# EAGLE design Engine Room ADUM Arduino (EAGLE 6.2)
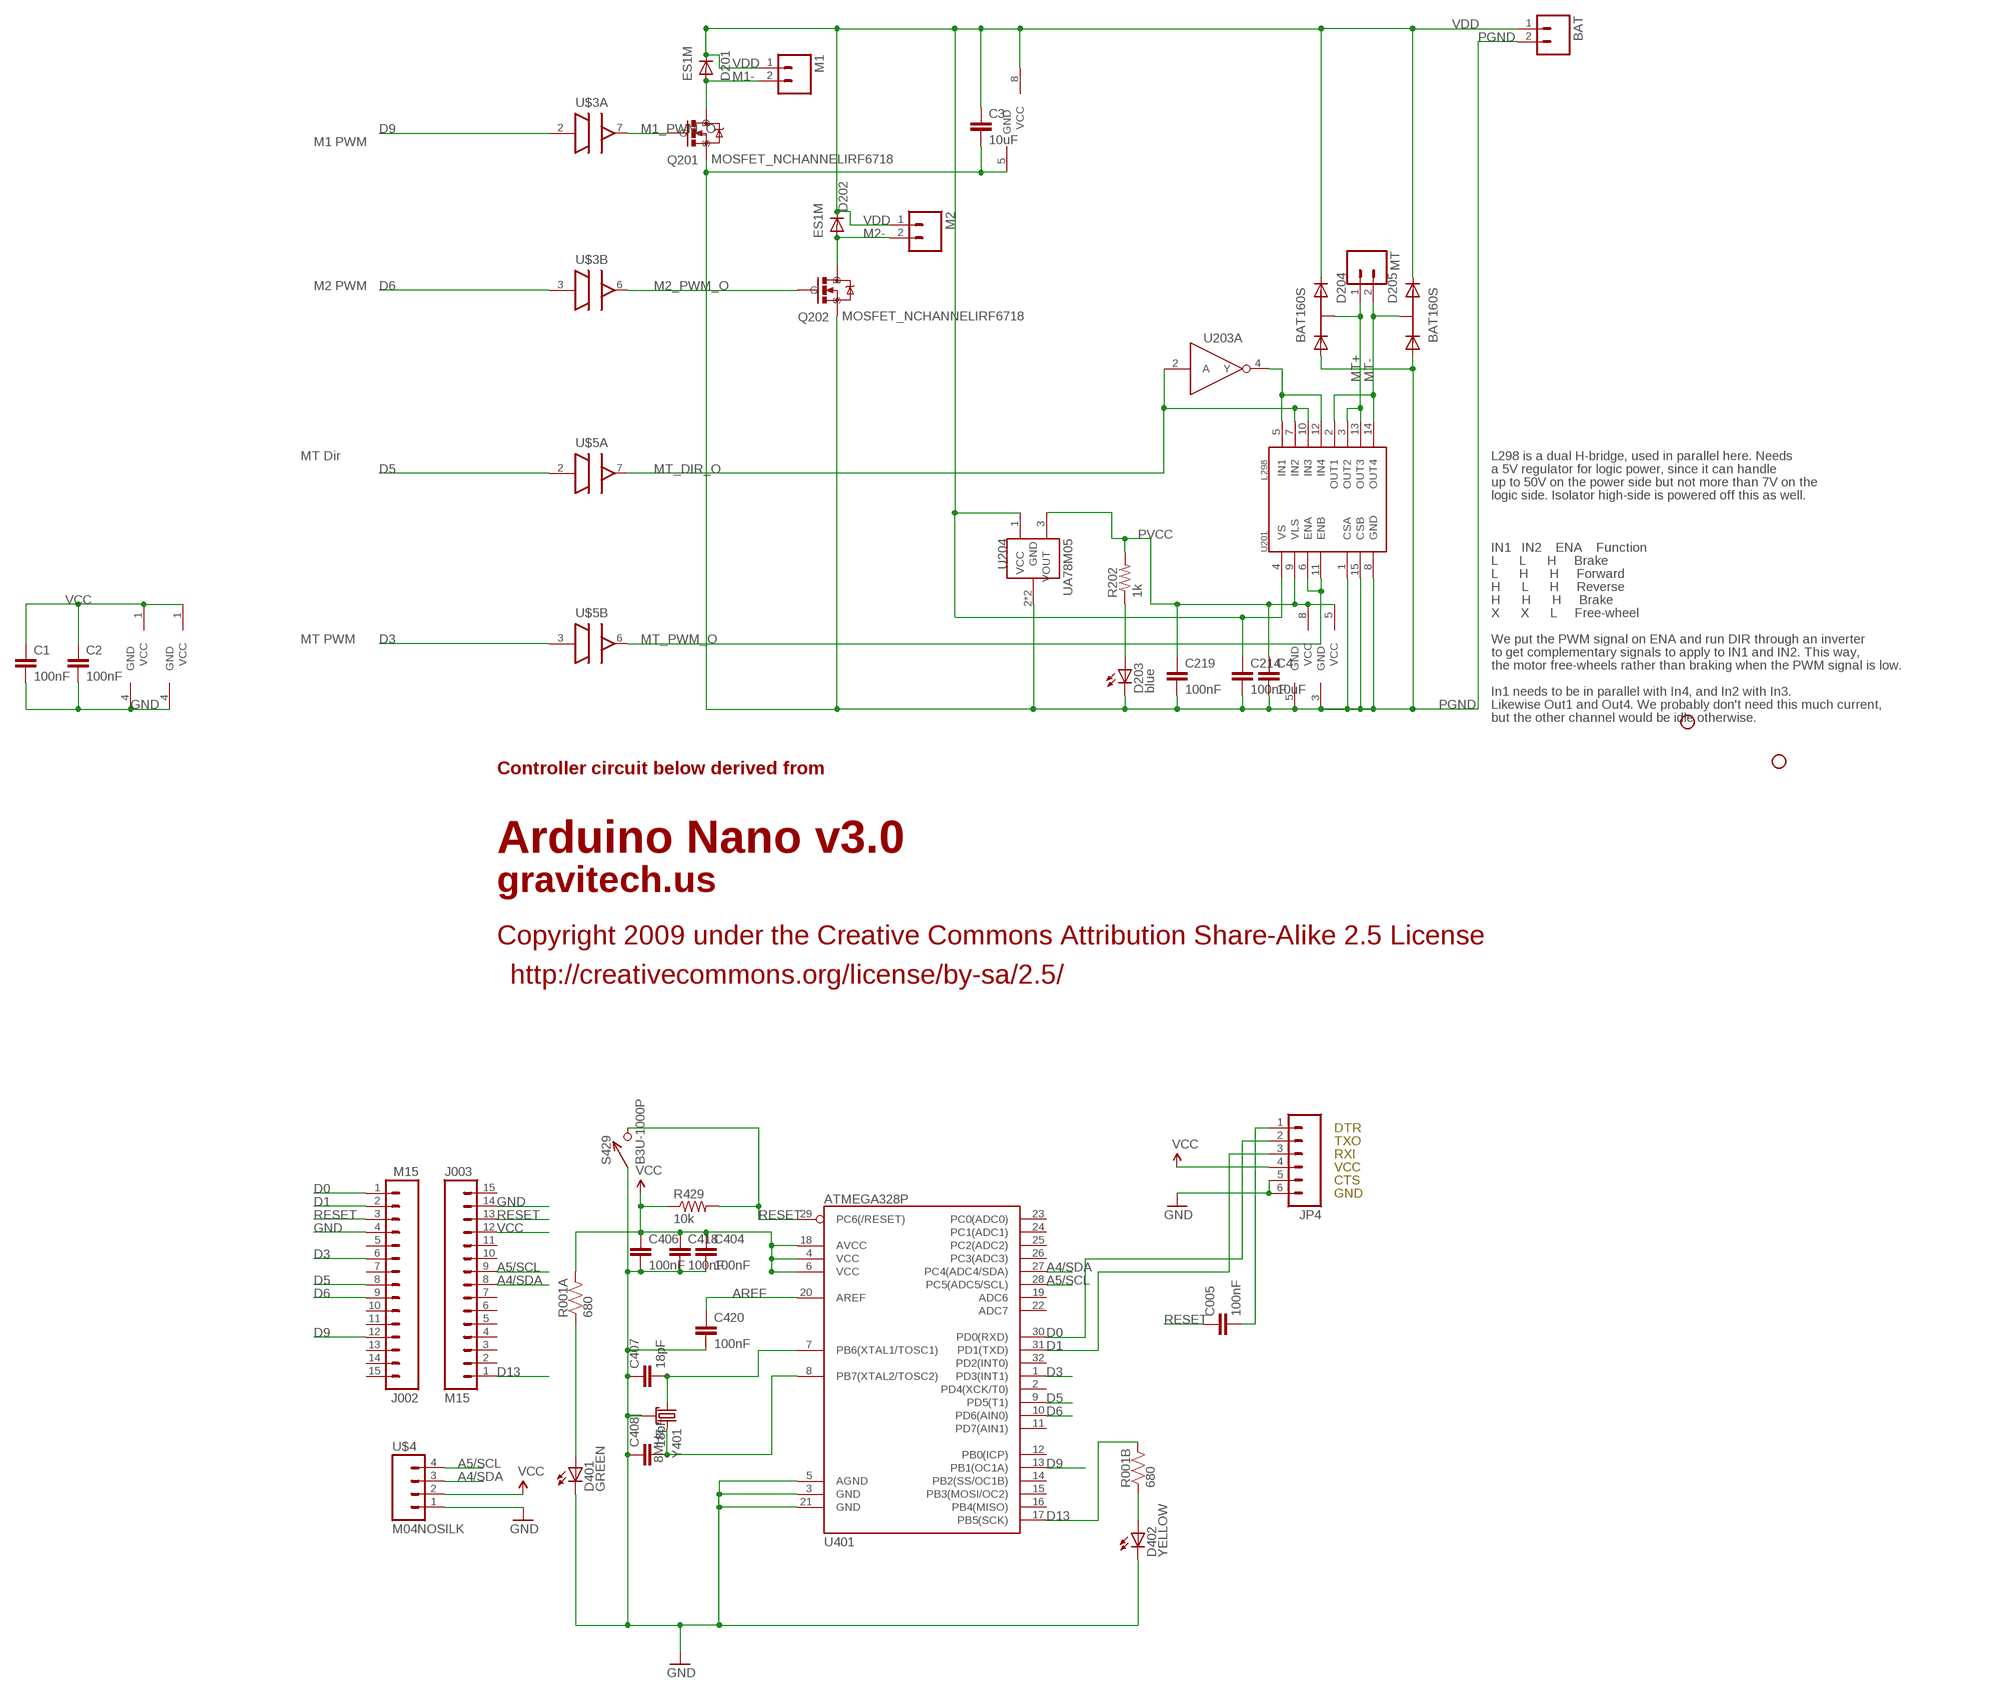
[diagram p0: schematic, sheet 1]

## Parts
BAT  M02PTH4  [1X02_XTRA_BIG]
C1  100nF  CAP0402-CAP  [0402-CAP]
C2  100nF  CAP0402-CAP  [0402-CAP]
C3  10uF  CAP1206  [1206]
C4  10uF  CAP1206  [1206]
C005  100nF  CAP0402-CAP  [0402-CAP]
C214  100nF  CAP1206  [1206]
C219  100nF  CAP0402-CAP  [0402-CAP]
C404  100nF  CAP0402-CAP  [0402-CAP]
C406  100nF  CAP0402-CAP  [0402-CAP]
C407  18pF  CAP0402-CAP  [0402-CAP]
C408  18pF  CAP0402-CAP  [0402-CAP]
C418  100nF  CAP0402-CAP  [0402-CAP]
C420  100nF  CAP0402-CAP  [0402-CAP]
D201  ES1M  DIODE-DO-214AC  [DO-214AC]
D202  ES1M  DIODE-DO-214AC  [DO-214AC]
D203  blue  LED0603  [LED-0603]
D204  BAT160S  [SOT-223]
D205  BAT160S  [SOT-223]
D401  GREEN  LED0603  [LED-0603]
D402  YELLOW  LED0603  [LED-0603]
J002  M15  [1X15]
J003  M15  [1X15]
JP1  STAND-OFF  [STAND-OFF]
JP2  STAND-OFF  [STAND-OFF]
JP4  M06SIP  [1X06]
M1  M02PTH4  [1X02_XTRA_BIG]
M2  M02PTH4  [1X02_XTRA_BIG]
MT  M02PTH  [1X02]
Q201  MOSFET_NCHANNELIRF6718  [DIRECTFET_L6]
Q202  MOSFET_NCHANNELIRF6718  [DIRECTFET_L6]
R001  680  RP2EXB24V  [CRA02]
R202  1k  RESISTOR0402-RES  [0402-RES]
R429  10k  RESISTOR0402-RES  [0402-RES]
S429  B3U-1000P  [B3U-1000P]
U201  L298  [MULTIWATT15]
U203  MC74VHC1G04  [SOT-23-5]
U204  UA78M05  [SOT-223]
U401  ATMEGA328P  ATMEGA168  [TQFP32-08]
U$3  ADUM3221  [SO8N]
U$4  M04NOSILK  [M04SIP]
U$5  ADUM3221  [SO8N]
Y401  8MHz  CX2520  [CRYSTAL_SMD_2MM_2_5MM]

## Nets
A4/SDA: J003.8 U401.27(PC4(ADC4/SDA)) U$4.3
A5/SCL: J003.9 U401.28(PC5(ADC5/SCL)) U$4.4
AREF: C420.1 U401.20(AREF)
D0: J002.1 JP4.2 U401.30(PD0(RXD))
D1: J002.2 JP4.3 U401.31(PD1(TXD))
D3: J002.6 U401.1(PD3(INT1)) U$5.3(B:IN)
D5: J002.8 U401.9(PD5(T1)) U$5.2(A:IN)
D6: J002.9 U401.10(PD6(AIN0)) U$3.3(B:IN)
D9: J002.12 U401.13(PB1(OC1A)) U$3.2(A:IN)
D13: J003.1 R001.3 U401.17(PB5(SCK))
DTR#: C005.2 JP4.1
GND: C1.2 C2.2 C404.2 C406.2 C407.1 C408.1 C418.2 C420.2 D401.C D402.C J002.4 J003.14 JP4.5 JP4.6 S429.P$1 U401.3(GND) U401.5(AGND) U401.21(GND) U$3.4(INP:GND) U$4.1 U$5.4(INP:GND) Y401.2(GND) Y401.4(GND)
M1- [power]: D201.A M1.2 Q201.D1(D) Q201.D2(D)
M1_PWM_O: Q201.G U$3.7(A:OUT)
M2- [power]: D202.A M2.2 Q202.D1(D) Q202.D2(D)
M2_PWM_O: Q202.G U$3.6(B:OUT)
MT+ [lt_power]: D204.4(K1A2) MT.1 U201.3(OUT2) U201.13(OUT3)
MT- [lt_power]: D205.4(K1A2) MT.2 U201.2(OUT1) U201.14(OUT4)
MT_DIR_O: U201.7(IN2) U201.10(IN3) U203.2(A:A) U$5.7(A:OUT)
MT_PWM_O: U201.6(ENA) U201.11(ENB) U$5.6(B:OUT)
N$1: D203.A R202.1
N$2: U201.5(IN1) U201.12(IN4) U203.4(A:Y)
N$3: C407.2 U401.7(PB6(XTAL1/TOSC1)) Y401.1
N$4: C408.2 U401.8(PB7(XTAL2/TOSC2)) Y401.3
N$7: D401.A R001.1
N$8: D402.A R001.2
PGND [power]: BAT.2 C3.2 C4.2 C214.2 C219.2 D203.C D204.1(A1) D205.1(A1) Q201.S Q202.S U201.1(CSA) U201.8(GND) U201.15(CSB) U203.3(PWR:GND) U204.2(GND) U204.4(GND) U$3.5(OUTP:GND) U$5.5(OUTP:GND)
PVCC: C4.1 C219.1 R202.2 U201.9(VLS) U203.5(PWR:VCC) U204.3(VOUT) U$5.8(OUTP:VCC)
RESET: C005.1 J002.3 J003.13 R429.2 S429.P$2 U401.29(PC6(/RESET))
VCC: C1.1 C2.1 C404.1 C406.1 C418.1 J003.12 JP4.4 R001.4 R429.1 U401.4(VCC) U401.6(VCC) U401.18(AVCC) U$3.1(INP:VCC) U$4.2 U$5.1(INP:VCC)
VDD [power]: BAT.1 C3.1 C214.1 D201.C D202.C D204.3(K2) D205.3(K2) M1.1 M2.1 U201.4(VS) U204.1(VCC) U$3.8(OUTP:VCC)
Unconnected: J002.5 J002.7 J002.10 J002.11 J002.13 J002.14 J002.15 J003.2 J003.3 J003.4 J003.5 J003.6 J003.7 J003.10 J003.11 J003.15 U401.2(PD4(XCK/T0)) U401.11(PD7(AIN1)) U401.12(PB0(ICP)) U401.14(PB2(SS/OC1B)) U401.15(PB3(MOSI/OC2)) U401.16(PB4(MISO)) U401.19(ADC6) U401.22(ADC7) U401.23(PC0(ADC0)) U401.24(PC1(ADC1)) U401.25(PC2(ADC2)) U401.26(PC3(ADC3)) U401.32(PD2(INT0))

## Notes on the sheet
- M1 PWM
- M2 PWM
- MT Dir | L298 is a dual H-bridge, used in parallel here. Needs
- a 5V regulator for logic power, since it can handle
- up to 50V on the power side but not more than 7V on the
- logic side. Isolator high-side is powered off this as well.
- IN1   IN2    ENA    Function
- L      L      H     Brake
- L      H      H     Forward
- H      L      H     Reverse
- H      H      H     Brake
- X      X      L     Free-wheel
- MT PWM | We put the PWM signal on ENA and run DIR through an inverter
- to get complementary signals to apply to IN1 and IN2. This way,
- the motor free-wheels rather than braking when the PWM signal is low.
- In1 needs to be in parallel with In4, and In2 with In3.
- Likewise Out1 and Out4. We probably don't need this much current,
- but the other channel would be idle otherwise.
- Controller circuit below derived from
- Arduino Nano v3.0
- gravitech.us
- Copyright 2009 under the Creative Commons Attribution Share-Alike 2.5 License
- http://creativecommons.org/license/by-sa/2.5/
- DTR
- TXO
- RXI
- VCC
- CTS
- GND

## Library data of the parts
BAT M1 M2 MT = SparkFun:M02: Header 2 Standard 2-pin 0.1" header. Use with straight break away headers (SKU : PRT-00116), right angle break away headers (PRT-00553), swiss pins (PRT-00743), machine pins (PRT-00117), and female headers (PRT-00115). Molex polarized connector foot print use with SKU : PRT-08233 with associated crimp pins and housings.
C1 C2 C219 = SparkFun:CAP: Capacitor Standard 0603 ceramic capacitor, and 0.1" leaded capacitor.
C3 C4 C214 = SparkFun-Passives:CAP: Capacitor Standard 0603 ceramic capacitor, and 0.1" leaded capacitor.
C005 C404 C406 C418 C420 = SparkFun:CAP: Capacitor Standard 0603 ceramic capacitor, and 0.1" leaded capacitor.; DIGIKEY: 445-1268-1-ND
C407 C408 = SparkFun:CAP: Capacitor Standard 0603 ceramic capacitor, and 0.1" leaded capacitor.; DIGIKEY: 445-1238-1-ND
D201 D202 = diode:DIODE-: DIODE
D203 = SparkFun:LED: LEDs Standard schematic elements and footprints for 5mm, 3mm, 1206, and 0603 sized LEDs. 5mm - Spark Fun Electronics SKU : COM-00529 (and others)
D204 D205 = KwanSystems:BAT160S
D401 = SparkFun-LED:LED: LEDs Standard schematic elements and footprints for 5mm, 3mm, 1206, and 0603 sized LEDs. 5mm - Spark Fun Electronics SKU : COM-00529 (and others); DIGIKEY: 350-2036-1-ND
D402 = SparkFun-LED:LED: LEDs Standard schematic elements and footprints for 5mm, 3mm, 1206, and 0603 sized LEDs. 5mm - Spark Fun Electronics SKU : COM-00529 (and others); DIGIKEY: 754-1124-1-ND
J002 J003 = SparkFun-Connectors:M15: Header 15 Standard 15-pin 0.1" header. Use with straight break away headers (SKU : PRT-00116), right angle break away headers (PRT-00553), swiss pins (PRT-00743), machine pins (PRT-00117), and female headers (PRT-00115).; DIGIKEY: $NOPART
JP1 JP2 = SparkFun:STAND-OFF: Stand Off This is the mechanical footprint for a #4 phillips button head screw. Use the keepout ring to avoid running the screw head into surrounding components. SKU : PRT-00447
JP4 = SparkFun-Connectors:M06: Header 6 Standard 6-pin 0.1" header. Use with straight break away headers (SKU : PRT-00116), right angle break away headers (PRT-00553), swiss pins (PRT-00743), machine pins (PRT-00117), and female headers (PRT-00115). Molex polarized connector foot print use with SKU : PRT-08094 with associated crimp pins and housings. NOTES ON THE VARIANTS LOCK and LOCK_LONGPADS... This footprint was designed to help hold the alignment of a through-hole component (i.e. 6-pin header) while soldering it into place. You may notice that each hole has been shifted either up or down by 0.005 of an inch from it's more standard position (which is a perfectly straight line). This slight alteration caused the pins (the squares in the middle) to touch the edges of the holes. Because they are alternating, it causes a "brace" to hold the component in place. 0.005 has proven to be the perfect amount of "off-center" position when using our standard breakaway headers. Although looks a little odd when you look at the bare footprint, once you have a header in there, the alteration is very hard to notice. Also,if you push a header all the way into place, it is covered up entirely on the bottom side. This idea of altering the position of holes to aid alignment will be further integrated into the Sparkfun Library for other footprints. It can help hold any component with 3 or more connection pins.
Q201 Q202 = KwanSystems:MOSFET_NCHANNEL
R001 = KwanSystems:RP2; DIGIKEY: CRA4S8680CT-ND
R202 = SparkFun:RESISTOR: Resistor Basic schematic elements and footprints for 0603, 1206, and PTH resistors.
R429 = SparkFun-Passives:RESISTOR: Resistor Basic schematic elements and footprints for 0603, 1206, and PTH resistors.; DIGIKEY: P10.0KLCT-ND
S429 = KwanSystems:B3U-1000P
U201 = SparkFun:L298: L298 Dual Full Bridge Driver
U203 = KwanSystems:MC74VHC1G04
U204 = KwanSystems:UA78M05
U401 = SparkFun-DigitalIC:ATMEGA168: Atmel 32-pin 8-bit micro, 16k flash.; DIGIKEY: ATMEGA328P-15AZCT-ND
U$3 U$5 = KwanSystems:ADUM3221
U$4 = KwanSystems:M04
Y401 = KwanSystems:CX2520

## Net classes
0 default: width 0.152 mm, drill 0.33 mm, clearance 0.152 mm
1 power: width 0.152 mm, drill 0.33 mm, clearance 0.152 mm to class 0, clearance 0.152 mm
2 lt_power: width 0.152 mm, drill 0.33 mm, clearance 0.254 mm to class 0, clearance 0.254 mm to class 1, clearance 0.254 mm

## Board
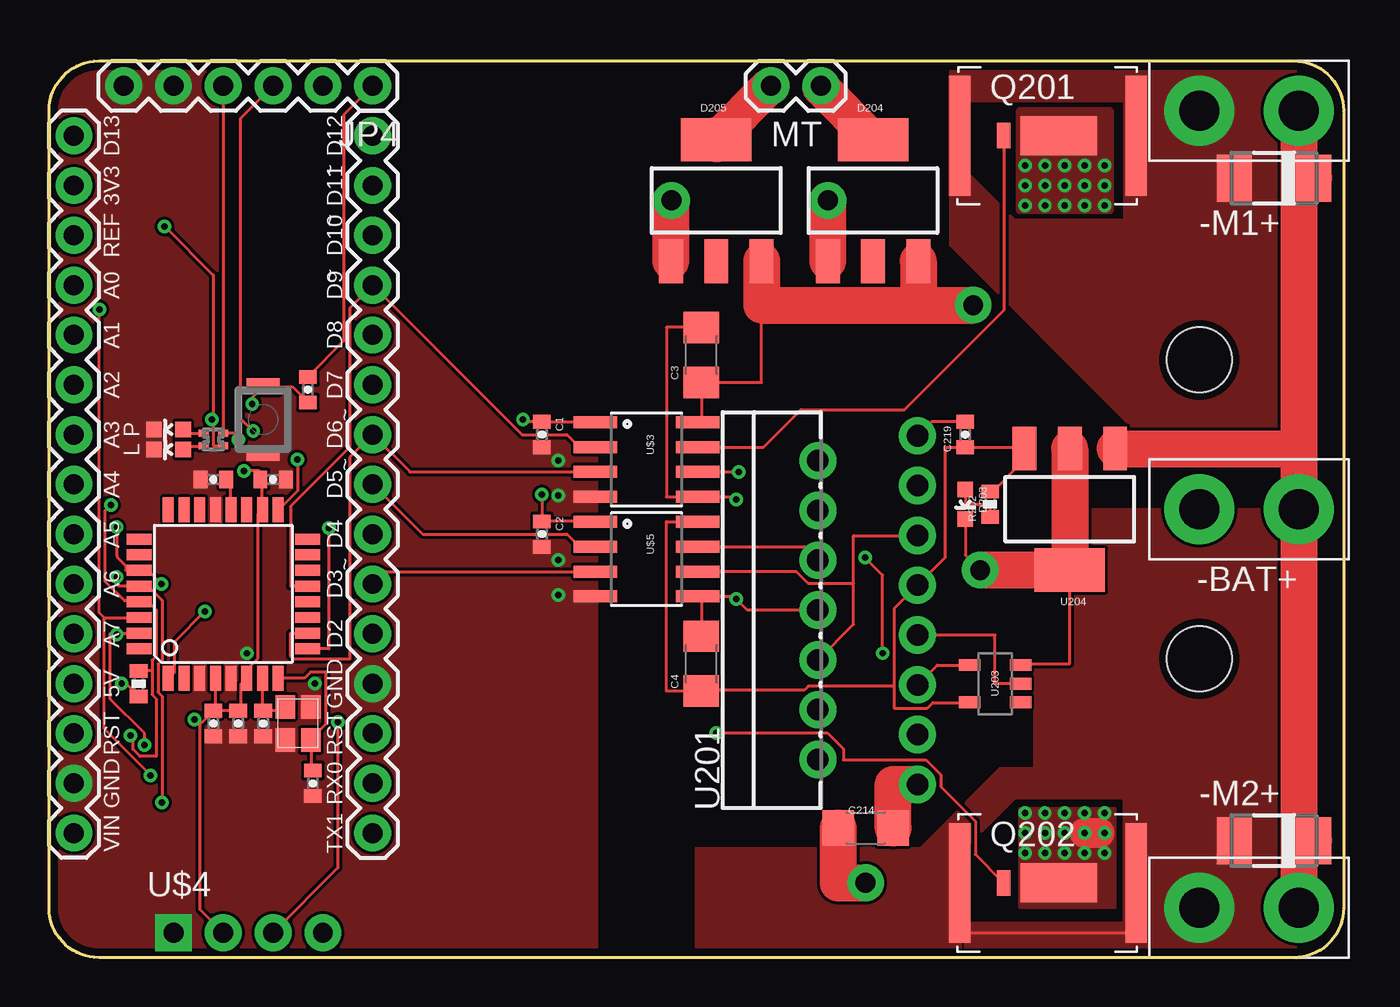
[diagram p1: board, top side]
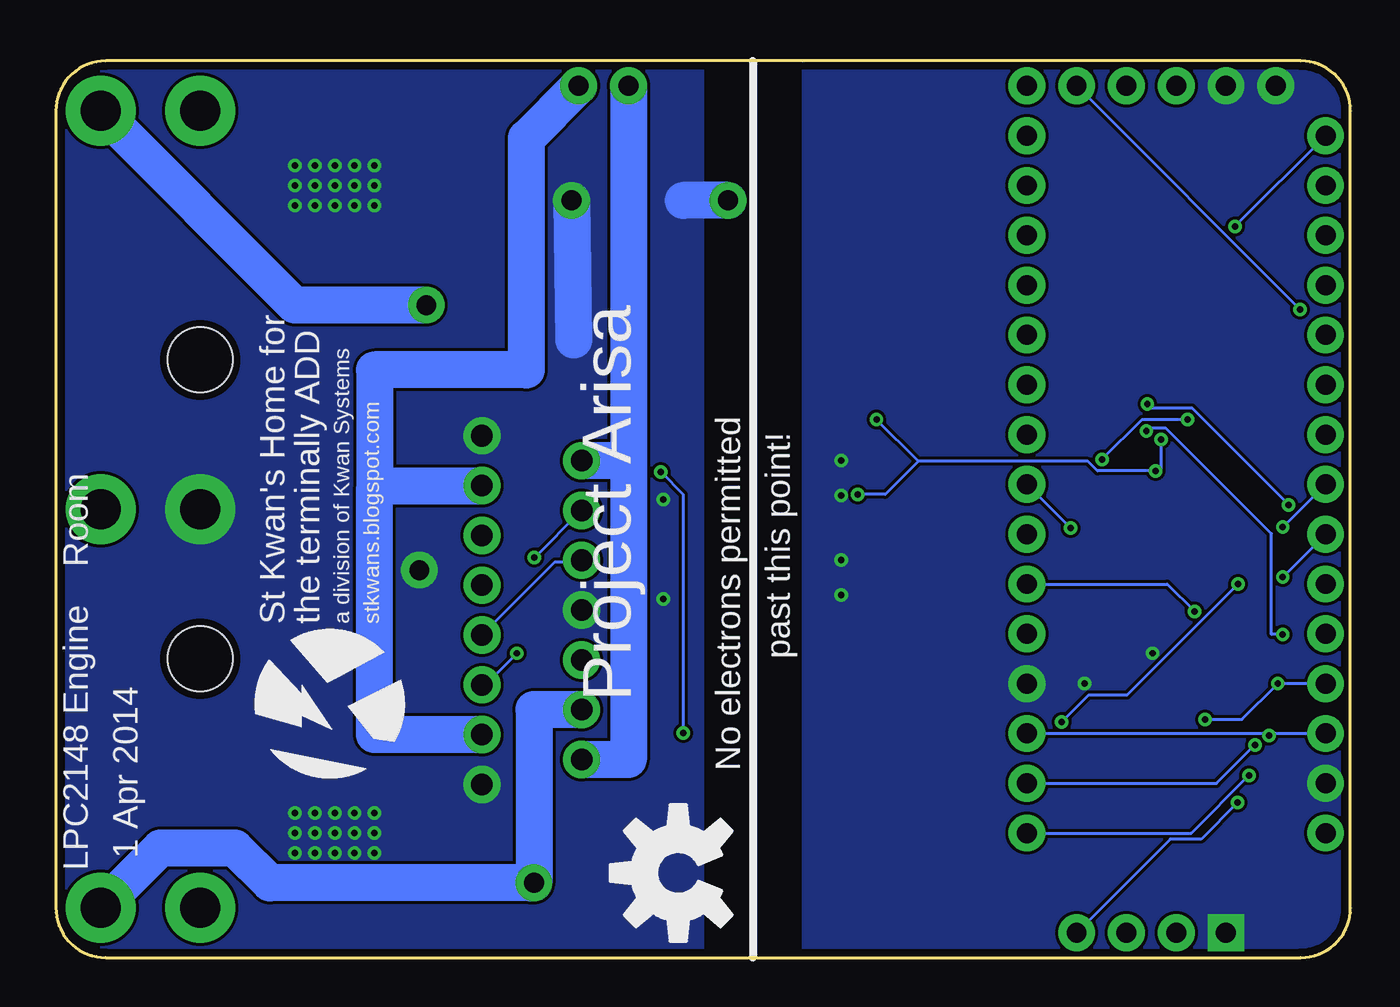
[diagram p2: board, bottom side, seen from below]

Size 66.04 x 45.72 mm. Coordinates in mm from the lower left corner, seen from the top.
Outline: 2.54,45.72 63.5,45.72 arc-90 66.04,43.18 66.04,2.54 arc-90 63.5,0 2.54,0 arc-90 0,2.54 0,43.18 arc-90 2.54,45.72
Copper layers (1*16): Top 0.0356mm / dielectric 1.5011mm / Bottom 0.0356mm
Design rules: minimum track width 6mil, minimum drill 13mil, track to track 6mil, track to pad 6mil, pad to pad 6mil, via to via 6mil, smd to smd 6mil, copper to edge 15mil, drill to drill 6mil, minimum pad ring 7mil, minimum via ring 7mil, stop-mask expansion 4mil, vias tented up to drill 21mil, thermal gap 10mil

### Footprints (pad centres in the part's own frame; a part is rotated, then mirrored left to right if it is on the bottom)
1X02_XTRA_BIG = drill 2.057 pad 3.556: 1 -2.54,0; 2 2.54,0
0402-CAP = smd 0.7 x 0.9: 1 -0.65,0; 2 0.65,0
1206 = smd 1.6 x 1.8: 1 -1.4,0; 2 1.4,0
DO-214AC = smd 1.8 x 2.4: A 2.025,0; C -2.025,0
LED-0603 = smd 0.8 x 0.8: A 0,-0.75; C 0,0.75
SOT-223 = smd 1.219 x 2.235: 1 -2.311,-3.099; 2 0,-3.099; 3 2.311,-3.099 | smd 3.6 x 2.2: 4 0,3.099
1X15 = drill 1.016 pad 1.88: 1 0,0; 2 2.54,0; 3 5.08,0; 4 7.62,0; 5 10.16,0; 6 12.7,0; 7 15.24,0; 8 17.78,0; 9 20.32,0; 10 22.86,0; 11 25.4,0; 12 27.94,0; 13 30.48,0; 14 33.02,0; 15 35.56,0
STAND-OFF = hole 3.302: 0,0
1X06 = drill 1.016 pad 1.88: 1 0,0; 2 2.54,0; 3 5.08,0; 4 7.62,0; 5 10.16,0; 6 12.7,0
1X02 = drill 1.016 pad 1.88: 1 0,0; 2 2.54,0
DIRECTFET_L6 = smd 1.1 x 6.1: D1 -4.35,0; D2 4.65,0 | smd 0.7 x 1.3: G -2.1,0 | smd 3.9 x 2: S 0.7,0
CRA02 = smd 0.35 x 0.5: 1 -0.325,-0.5; 2 0.325,-0.5; 3 0.325,0.5; 4 -0.325,0.5
0402-RES = smd 0.7 x 0.9: 1 -0.65,0; 2 0.65,0
B3U-1000P = smd 0.8 x 1.7: P$1 -1.7,0; P$2 1.7,0
MULTIWATT15 = drill 1.1 pad 1.9: 1 -8.95,-2.39; 2 -7.68,2.69; 3 -6.41,-2.39; 4 -5.14,2.69; 5 -3.87,-2.39; 6 -2.6,2.69; 7 -1.33,-2.39; 8 -0.06,2.69; 9 1.21,-2.39; 10 2.48,2.69; 11 3.75,-2.39; 12 5.02,2.69; 13 6.29,-2.39; 14 7.56,2.69; 15 8.83,-2.39
SOT-23-5 = smd 0.6 x 1.1: 1 -0.95,-1.3; 2 0,-1.3; 3 0.95,-1.3; 4 0.95,1.3; 5 -0.95,1.3
TQFP32-08 = smd 1.27 x 0.559: 1 -4.293,2.8; 2 -4.293,2; 3 -4.293,1.2; 4 -4.293,0.4; 5 -4.293,-0.4; 6 -4.293,-1.2; 7 -4.293,-2; 8 -4.293,-2.8; 17 4.293,-2.8; 18 4.293,-2; 19 4.293,-1.2; 20 4.293,-0.4; 21 4.293,0.4; 22 4.293,1.2; 23 4.293,2; 24 4.293,2.8 | smd 0.559 x 1.27: 9 -2.8,-4.293; 10 -2,-4.293; 11 -1.2,-4.293; 12 -0.4,-4.293; 13 0.4,-4.293; 14 1.2,-4.293; 15 2,-4.293; 16 2.8,-4.293; 25 2.8,4.293; 26 2,4.293; 27 1.2,4.293; 28 0.4,4.293; 29 -0.4,4.293; 30 -1.2,4.293; 31 -2,4.293; 32 -2.8,4.293
SO8N = smd 0.61 x 2.21: 1 -1.905,-2.616; 2 -0.635,-2.616; 3 0.635,-2.616; 4 1.905,-2.616; 5 1.905,2.616; 6 0.635,2.616; 7 -0.635,2.616; 8 -1.905,2.616
M04SIP = drill 1.016 pad 1.88 square: 1 0,0 | drill 1.016 pad 1.88: 2 2.54,0; 3 5.08,0; 4 7.62,0
CRYSTAL_SMD_2MM_2_5MM = smd 1.2 x 1: 1 -0.85,-0.65; 2 0.85,-0.65; 3 0.85,0.65; 4 -0.85,0.65

### Placement (x,y rotation side)
BAT  61.21,22.86 180 top
C1  25.15,26.67 270 top
C2  25.15,21.59 270 top
C3  33.27,30.73 90 top
C4  33.27,14.99 90 top
C005  13.21,28.96 90 top
C214  41.66,6.6 0 top
C219  46.74,26.67 90 top
C404  8.38,11.94 270 top
C406  9.65,11.94 270 top
C407  10.92,11.94 90 top
C408  13.46,8.89 90 top
C418  11.43,24.38 0 top
C420  8.38,24.38 180 top
D201  62.48,39.75 180 top
D202  62.48,5.97 180 top
D203  46.74,23.11 180 top
D204  42.04,38.61 0 top
D205  34.04,38.61 0 top
D401  6.1,26.92 90 top
D402  6.1,25.91 90 top
J002  16.51,6.35 90 top
J003  1.27,41.91 270 top
JP1  58.67,15.24 0 top
JP2  58.67,30.48 90 top
JP4  16.51,44.45 180 top
M1  61.21,43.18 180 top
M2  61.21,2.54 180 top
MT  39.37,44.45 180 top
Q201  50.8,41.91 0 top
Q202  50.8,3.81 0 top
R001  8.38,26.42 270 top
R202  48.01,23.11 90 top
R429  4.57,13.97 90 top
S429  10.92,27.43 90 top
U201  41.91,17.78 90 top
U203  48.26,13.97 90 top
U204  52.07,22.86 180 top
U401  8.89,18.54 90 top
U$1  [KWAN_CIRCLE]  52.07,12.95 90 bottom
U$2  [OSHW-LOGO-L]  34.29,4.32 90 bottom
U$3  30.48,25.4 270 top
U$4  6.35,1.27 0 top
U$5  30.48,20.32 270 top
Y401  12.7,11.94 270 top

### Tracks (layer width: path | path; a pad name or v marks a point on that pad's centre or on a via)
A4/SDA  (via drill 0.33)
  Top 0.152: v3.45,21.95 3.45,20.45 3.91,19.99 3.91,19.76 4.6,19.76 U401.27 4.65,19.71 5.08,19.71 v5.74,19.05 | U$4.3 14.73,4.57 v14.73,12.01
  Bottom 0.152: J003.8 v3.45,21.95 | v14.73,12.01 13.36,13.39 11.4,13.39 v5.74,19.05
A5/SCL  (via drill 0.33)
  Top 0.152: v3.45,19.41 3.53,19.33 3.53,18.95 U401.28 4.65,18.9 5.08,18.9 5.77,18.21 5.77,15.16 5.56,14.96 5.56,13.54 5.77,13.34 v5.77,7.9
  Bottom 0.152: J003.9 v3.45,19.41 | U$4.4 9.2,6.04 7.62,6.04 v5.77,7.9
AREF
  Top 0.152: C420.1 9.04,24.38 9.27,24.16 9.27,22.84 U401.20
D0  (via drill 0.33)
  Top 0.152: 2.82,17.32 4.6,17.32 U401.30 | 2.82,17.32 2.82,11.66 v5.18,9.3 | v2.56,33.05 2.56,17.58 2.82,17.32
  Bottom 0.152: v5.18,9.3 8.13,6.35 J002.1 | v2.56,33.05 JP4.2
D1  (via drill 0.33)
  Top 0.152: 3.45,16.54 3.12,16.54 3.12,13.18 4.88,11.43 v4.88,10.85 | 3.45,16.54 U401.31 | JP4.3 9.78,42.8 9.78,27.48 v10.41,26.85 | v3.45,16.48 3.45,16.54
  Bottom 0.152: v4.88,10.85 6.83,8.89 J002.2 | v10.41,26.85 10.26,27 9.42,27 4.04,21.61 4.04,16.48 v3.45,16.48
D3  (via drill 0.33)
  Top 0.152: v7.95,17.65 6.38,16.08 6.38,14.53 U401.1 | J002.6 17.14,19.68 U$5.3
  Bottom 0.152: v7.95,17.65 9.35,19.05 J002.6
D5  (via drill 0.33)
  Top 0.152: v14.28,21.89 14.28,15.75 U401.9 | J002.8 19.05,21.59 26.42,21.59 27.05,20.95 U$5.2
  Bottom 0.152: J002.8 v14.28,21.89
D6
  Top 0.152: U401.10 12.32,16.54 12.32,15.37 12.47,15.21 15.34,15.21 15.34,25.5 J002.9 18.41,24.77 U$3.3
D9
  Top 0.152: U401.13 12.32,18.95 12.32,23.01 15.34,26.04 15.34,33.12 J002.12 24.13,26.67 26.42,26.67 27.05,26.04 U$3.2
D13  (via drill 0.33)
  Top 0.152: 8.38,27.43 8.38,34.8 v5.89,37.29 | 8.38,27.43 8.38,26.11 8.87,26.11 R001.3 | v12.68,25.4 12.68,23.8 11.71,22.84 U401.17 | v8.31,27.43 8.38,27.43
  Bottom 0.152: J003.1 v5.89,37.29 | v12.68,25.4 10.64,27.43 v8.31,27.43
DTR#
  Top 0.152: JP4.1 15.04,42.98 15.04,31.45 C005.2
GND  (via drill 0.33)
  other vias: 13.56,13.97 10.08,15.52 25.98,25.35 25.98,20.27 25.98,23.57 25.98,18.49
  pour Bottom (no thermals): 2.54,45.72 27.94,45.72 27.94,0 2.54,0 arc-90 0,2.54 0,43.18 arc-90
  pour Top (no thermals): 2.54,45.72 27.94,45.72 27.94,0 2.54,0 arc-90 0,2.54 0,43.18 arc-90
M1-
  pour Top (no thermals): 45.97,45.72 45.97,43.69 54.86,43.69 54.86,37.59 49.28,37.59 46.74,40.13 46.74,43.43 45.97,43.43 45.97,36.32 55.12,27.18 55.12,26.42 66.04,26.42 66.04,43.18 arc90 63.5,45.72
M1_PWM_O
  Top 0.152: Q201.G 48.72,41.91 48.72,33.02 43.64,27.94 38.35,27.94 36.45,26.04 U$3.7
M2-
  Top 0.152: Q202.D1 46.74,3.52 46.74,1.27 55.45,1.27 Q202.D2
  pour Top (no thermals): 66.04,22.86 66.04,2.54 arc-90 63.5,0 46.74,0 46.74,1.78 54.86,1.78 54.86,8.13 49.28,8.13 46.48,5.33 46.48,0 33.02,0 33.02,5.59 44.45,5.59 48.51,9.65 50.29,9.65 50.29,22.86
M2_PWM_O  (via drill 0.33)
  Top 0.152: Q202.G 48.64,3.86 47.24,5.26 47.24,6.96 45.49,8.71 45.49,9.32 44.73,10.08 40.51,10.08 40.51,10.64 39.7,11.46 v34.04,11.46 | U$3.6 v35.18,24.77
  Bottom 0.152: v35.18,24.77 34.04,23.62 v34.04,11.46
MT+
  Top 1.88: MT.1 39.37,44.37 D204.4
  Bottom 1.88: U201.3 49.78,11.37 49.78,23.88 | 49.78,23.88 49.59,24.07 U201.13 | MT.1 42.04,41.78 42.04,29.97 49.78,29.97 49.78,23.88
MT-
  Top 1.88: MT.2 36.78,44.45 D205.4
  Top 2.286: 34.09,41.71 D205.4
  Bottom 1.88: MT.2 36.83,25.34 | 36.83,25.34 36.83,10.1 U201.2 | 36.83,25.34 U201.14
MT_DIR_O
  Top 0.152: U201.7 48.26,16.45 48.26,13.97 U203.2 | U201.10 38.52,20.95 U$5.7
  Bottom 0.152: U201.7 40.59,20.17 39.22,20.17 U201.10
MT_PWM_O
  Top 0.152: 41.05,19.07 41.05,16.99 39.24,15.19 U201.6 | 41.05,19.07 41.05,21.51 44.3,21.51 U201.11 | U$5.6 38.12,19.68 38.73,19.07 41.05,19.07
N$1
  Top 0.152: D203.A 46.74,23.11 48.01,23.11 R202.1
N$2  (via drill 0.33)
  Top 0.152: 46.94,14.91 U203.4 45.31,14.92 U201.5 | v41.63,20.4 42.52,19.51 v42.52,15.52
  Bottom 0.152: v41.63,20.4 39.24,22.78 U201.12 | v42.52,15.52 44.12,13.92 U201.5
N$3
  Top 0.152: Y401.1 12.04,12.78 12.04,12.6 C407.2 10.9,12.65 U401.7
N$4
  Top 0.152: C408.2 13.36,9.65 13.36,11.07 Y401.3 13.39,11.15 14.15,11.91 14.15,14.55 13.34,14.55 13.03,14.25 U401.8
N$7
  Top 0.152: R001.1 6.86,26.75 D401.A
N$8
  Top 0.152: R001.2 6.86,26.09 D402.A
N$9
  Bottom 0.152: 27.94,45.72 30.48,45.72
PGND  (via drill 0.33, 1.02 pad 1.88)
  Top 0.152: C219.2 | U203.3 49.3,14.91 | U203.3 | 46.79,27.3 C219.2 | 49.99,19.76 50.04,19.76 | U203.3 49.63,14.99 52.07,14.99 U204.4 | D203.C 46.74,20.52 v47.5,19.76 | U$5.5 33.27,18.41 | 33.27,18.41 C4.2 | C3.2 31.5,32.13 31.5,23.5 U$3.5 34.92,23.5 v35.05,23.37 | C219.2 45.01,27.32 U201.15 | 33.27,18.41 34.92,18.41 v35.05,18.29 35.62,17.72 U201.8
  Top 1.524: 53.59,6.35 v52.83,6.35
  Top 1.88: U204.2 U204.4 50.04,19.76 v47.5,19.76 | C214.2 43.06,8.83 U201.1 | D204.1 v39.73,38.61 | D205.1 31.73,38.58 v31.75,38.61
  Bottom 0.152: v35.05,23.37 35.05,23.11
  Bottom 1.88: v39.73,38.61 39.62,31.5 | v31.75,38.61 34.04,38.61
  other vias: 49.78,38.35 50.8,38.35 51.82,38.35 52.83,38.35 53.85,38.35 49.78,7.37 50.8,7.37 51.82,7.37 52.83,7.37 53.85,7.37 49.78,6.35 50.8,6.35 51.82,6.35 53.85,6.35 49.78,5.33 50.8,5.33 51.82,5.33 52.83,5.33 53.85,5.33 49.78,39.37 50.8,39.37 51.82,39.37 52.83,39.37 53.85,39.37 49.78,40.39 50.8,40.39 51.82,40.39 52.83,40.39 53.85,40.39
  pour Top (no thermals): 49.53,43.18 54.1,43.18 54.1,38.1 49.53,38.1
  pour Top (no thermals): 49.53,2.54 49.53,7.62 54.36,7.62 54.36,2.54
  pour Bottom (no thermals): 33.02,45.72 63.5,45.72 arc-90 66.04,43.18 66.04,2.54 arc-90 63.5,0 33.02,0
PVCC
  Top 0.152: 43.1,13.84 43.1,17.78 44.3,18.97 U201.9 45.72,20.41 45.72,26.02 C219.1 | 43.1,13.84 43.1,12.72 44.81,12.72 45.09,13.01 46.89,13.01 U203.5 | C219.1 49.76,26.01 U204.3 49.53,25.73 49.53,25.15 48.15,23.76 R202.2 | 46.69,25.96 C219.1 | U$5.8 31.5,22.23 31.5,13.59 C4.1 33.33,13.64 38.53,13.64 38.73,13.84 43.1,13.84
RESET  (via drill 0.33)
  Top 0.152: C005.1 13.21,28.32 12.42,29.11 10.92,29.11 S429.P$2 10.87,29.06 10.36,28.55 v10.36,28.22 | 5.26,14.63 R429.2 | 5.26,14.63 5.26,15.16 5.46,15.37 5.46,17.73 5.05,18.14 U401.29 4.55,18.19 3.86,18.19 2.87,19.18 2.87,22.81 v3.15,23.09 | v4.17,11.33 4.29,11.2 4.29,10.62 4.65,10.26 5.46,10.26 5.46,13.21 5.26,13.41 5.26,14.63
  Bottom 0.152: J002.3 4.17,11.43 | 4.17,11.43 J003.13 | v10.36,28.22 10.16,28.02 8.08,28.02 v3.15,23.09 | v4.17,11.33 4.17,11.43
VCC  (via drill 0.33)
  Top 0.152: JP4.4 R001.4 8.97,26.75 9.65,26.75 v9.65,26.42 | v3.71,13.97 3.94,13.97 4.57,13.34 R429.1 | C404.1 C406.1 9.7,12.65 9.8,12.75 9.8,13.97 U401.6 10.13,14.3 10.13,14.73 10.67,15.27 10.67,22.63 10.82,22.78 U401.18 10.87,22.84 10.87,24.31 10.79,24.38 C418.1 10.74,24.43 10.74,24.82 v9.93,24.82 | U401.4 8.51,14.25 8.51,12.65 C404.1 | U$4.2 7.7,2.46 7.7,11.86 | 7.7,11.86 8.36,12.52 C404.1 | 7.7,11.86 v7.42,12.14 | U$3.1 25.15,27.3 C1.1 25.09,27.36 24.18,27.36 v24.18,27.43 | v25.15,23.62 C2.1 U$5.1
  Bottom 0.152: J003.12 v3.71,13.97 5.54,12.14 v7.42,12.14 | v9.65,26.42 9.65,24.82 v9.93,24.82 12.9,24.82 13.39,25.3 22.05,25.3 | 22.05,25.3 v24.18,27.43 | 22.05,25.3 23.72,23.62 v25.15,23.62
VDD  (via drill 1.02 pad 1.88)
  Top 0.152: U$3.8 32.51,27.3 32.51,27.18 33.27,27.18 C3.1 36.35,29.33 36.35,33.27
  Top 1.524: 63.75,36.35 63.75,34.8 | 63.75,25.96 BAT.1
  Top 1.88: M1.1 63.75,39.75 | 63.75,39.75 63.75,34.8 BAT.1 63.75,5.97 | D201.C 63.75,39.75 | 63.75,5.97 M2.1 | D202.C 63.75,5.97 | U204.1 63.75,25.96 | C214.1 40.26,3.81 v41.66,3.81 | D205.3 36.35,33.27 44.35,33.27 | D204.3 44.35,33.27 | 44.35,33.27 v47.14,33.27
  Bottom 1.88: v41.66,3.81 55.12,3.81 56.9,5.59 60.71,5.59 M2.1 | U201.4 41.66,12.64 v41.66,3.81 | v41.66,3.81 41.78,3.81 | v47.14,33.27 53.85,33.27 M1.1

### Text on the board
tPlace: D13 | D12 | ~ | 3V3 | D11 | ~ | REF | D10 | -M1+ | ~ | A0 | D9 | A1 | D8 | A2 | D7 | ~ | A3 | P | D6 | L | ~ | A4 | D5 | A5 | D4 | ~ | A6 | D3 | -BAT+ | A7 | D2 | 5V | GND | RST | RST | GND | RX0 | -M2+ | VIN | TX1
bPlace: stkwans.blogspot.com | a division of Kwan Systems | the terminally ADD | St Kwan's Home for | past this point! | Project Arisa | No electrons permitted | 1 Apr 2014 | LPC2148 Engine Room